# Altium schematic sheet SIX-INPORT.SchDoc
size A3
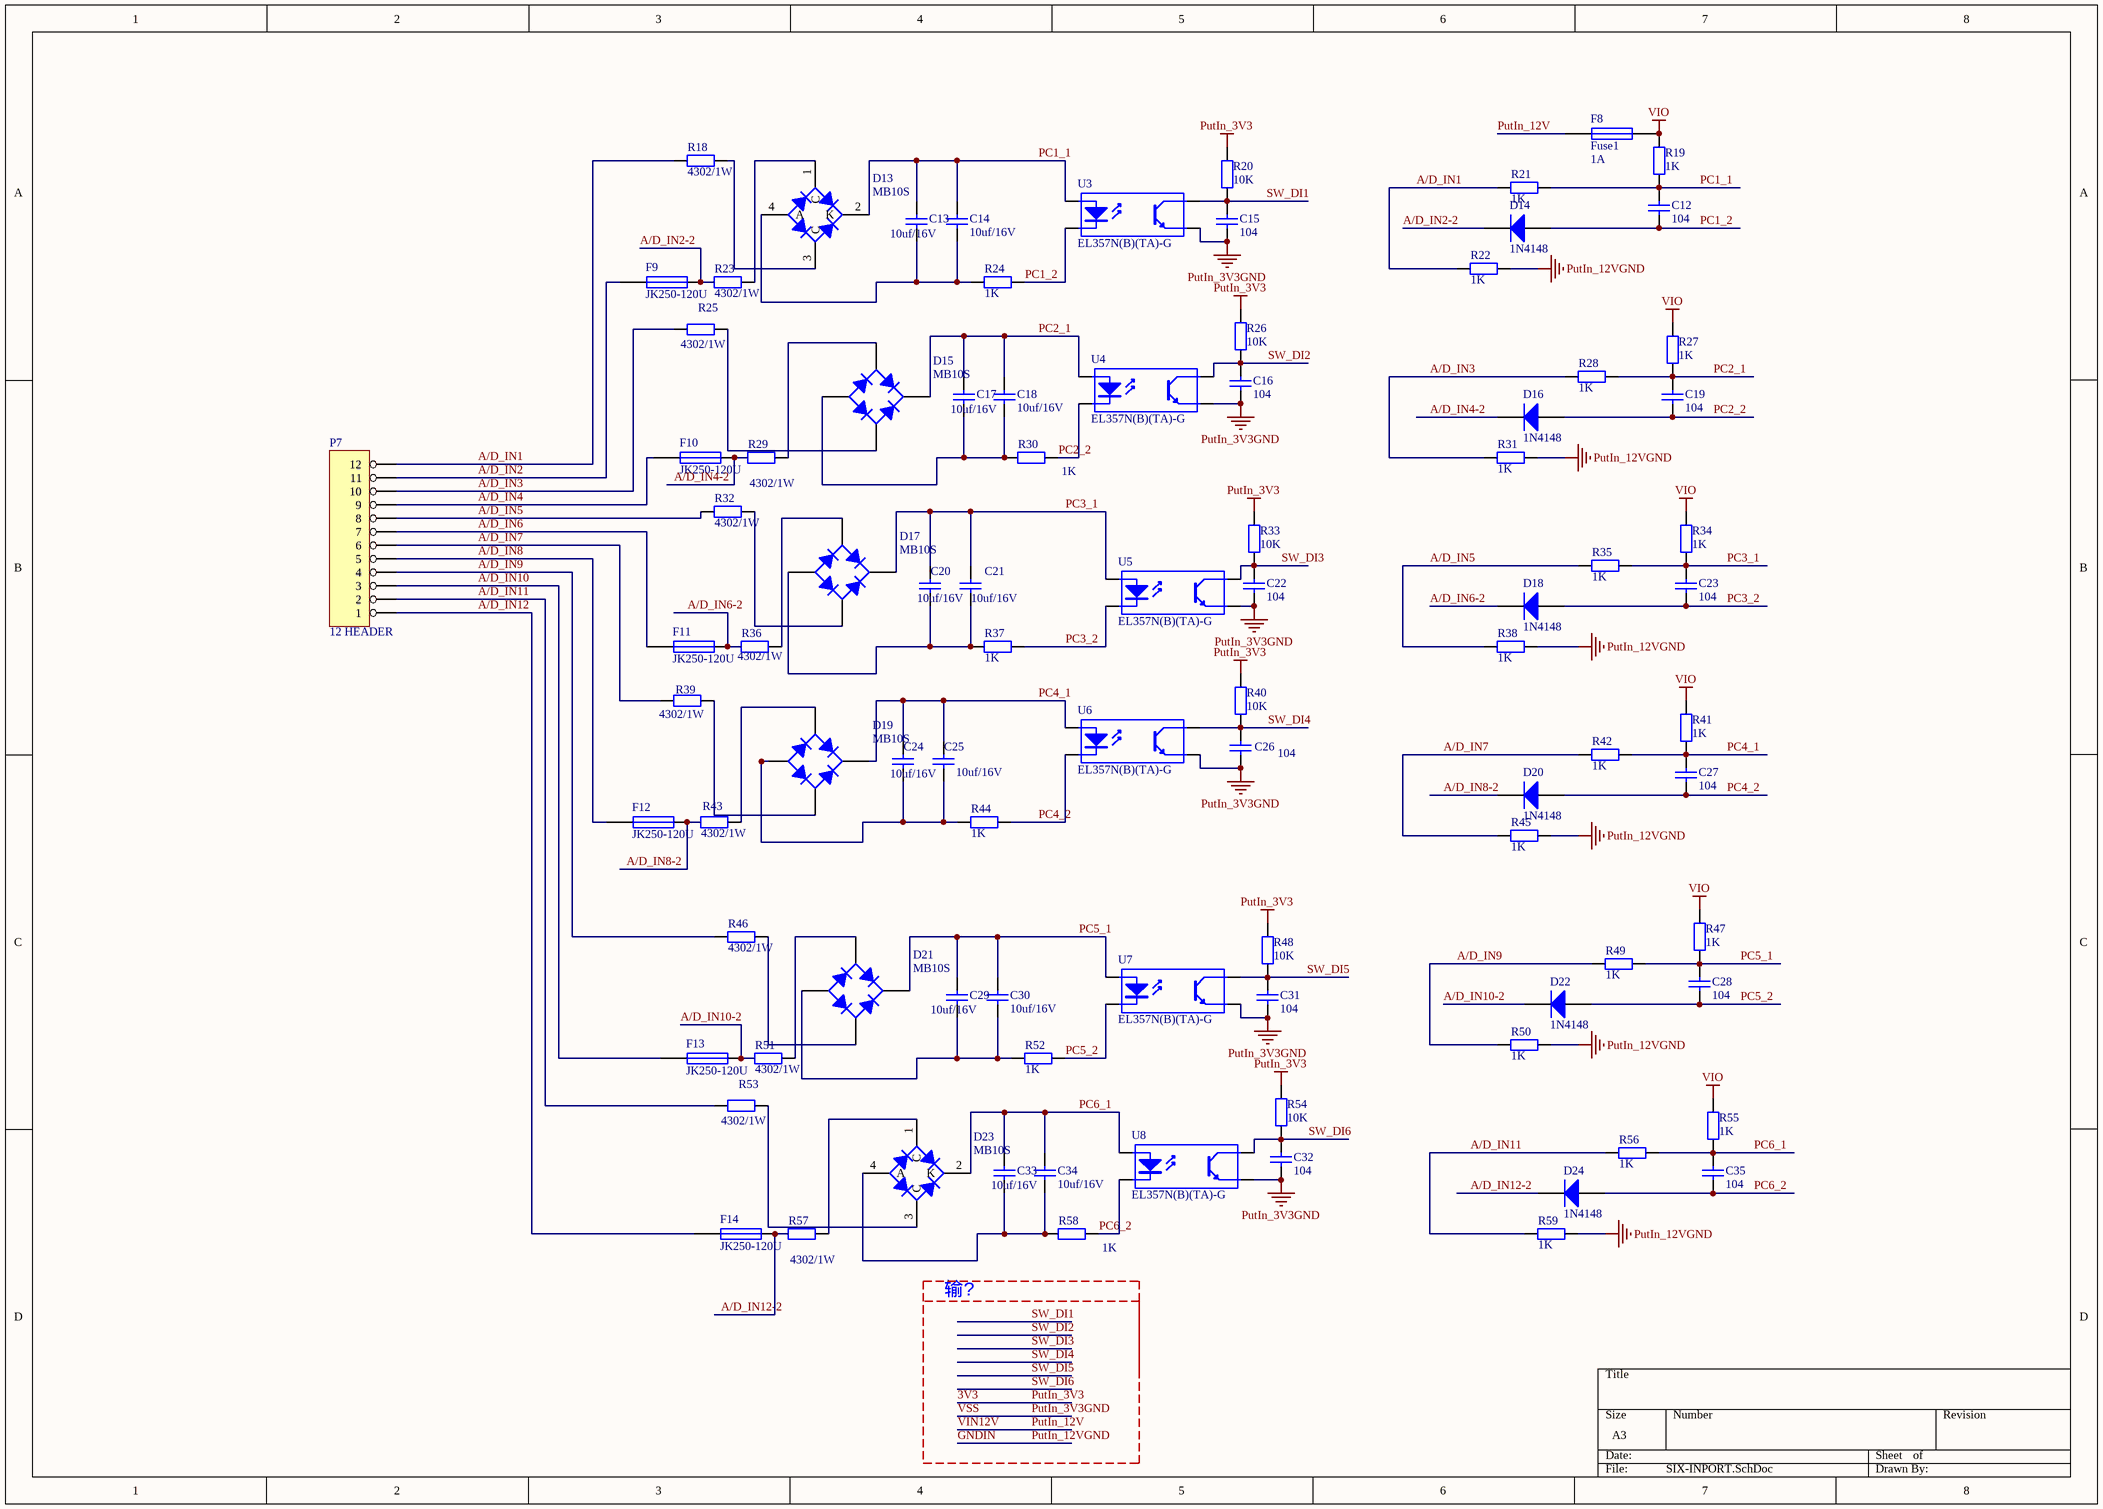
[diagram p0: SIX-INPORT.SchDoc]

## Parts
C12  104  [LC-1206_C]
C13  10uf/16V  [LC-0805_C]
C14  10uf/16V  [LC-0805_C]
C15  104  [LC-0603_C]
C16  104  [LC-0603_C]
C17  10uf/16V  [LC-0805_C]
C18  10uf/16V  [LC-0805_C]
C19  104  [LC-1206_C]
C20  10uf/16V  [LC-0805_C]
C21  10uf/16V  [LC-0805_C]
C22  104  [LC-0603_C]
C23  104  [LC-1206_C]
C24  10uf/16V  [LC-0805_C]
C25  10uf/16V  [LC-0805_C]
C26  104  [LC-0603_C]
C27  104  [LC-1206_C]
C28  104  [LC-1206_C]
C29  10uf/16V  [LC-0805_C]
C30  10uf/16V  [LC-0805_C]
C31  104  [LC-0603_C]
C32  104  [LC-0603_C]
C33  10uf/16V  [LC-0805_C]
C34  10uf/16V  [LC-0805_C]
C35  104  [LC-1206_C]
D13  MB10S  [LC-MBS]
D14  1N4148  [LC-LL-34]
D15  MB10S  [LC-MBS]
D16  1N4148  [LC-LL-34]
D17  MB10S  [LC-MBS]
D18  1N4148  [LC-LL-34]
D19  MB10S  [LC-MBS]
D20  1N4148  [LC-LL-34]
D21  MB10S  [LC-MBS]
D22  1N4148  [LC-LL-34]
D23  MB10S  [LC-MBS]
D24  1N4148  [LC-LL-34]
F8  Fuse1  value 1A  [LC-1206_R]
F9  JK250-120U  [ntc250v]
F10  JK250-120U  [ntc250v]
F11  JK250-120U  [ntc250v]
F12  JK250-120U  [ntc250v]
F13  JK250-120U  [ntc250v]
F14  JK250-120U  [ntc250v]
P7  12 HEADER  [KF2EDG508-12]
R18  4302/1W  [LC-2512_R]
R19  value 1K  [LC-1206_R]  (hidden comment: Res1)
R20  10K  [LC-0603_R]
R21  value 1K  [LC-1206_R]  (hidden comment: Res1)
R22  value 1K  [LC-1206_R]  (hidden comment: Res1)
R23  4302/1W  [LC-2512_R]
R24  1K  [LC-0603_R]
R25  4302/1W  [LC-2512_R]
R26  10K  [LC-0603_R]
R27  value 1K  [LC-1206_R]  (hidden comment: Res1)
R28  value 1K  [LC-1206_R]  (hidden comment: Res1)
R29  4302/1W  [LC-2512_R]
R30  1K  [LC-0603_R]
R31  value 1K  [LC-1206_R]  (hidden comment: Res1)
R32  4302/1W  [LC-2512_R]
R33  10K  [LC-0603_R]
R34  value 1K  [LC-1206_R]  (hidden comment: Res1)
R35  value 1K  [LC-1206_R]  (hidden comment: Res1)
R36  4302/1W  [LC-2512_R]
R37  1K  [LC-0603_R]
R38  value 1K  [LC-1206_R]  (hidden comment: Res1)
R39  4302/1W  [LC-2512_R]
R40  10K  [LC-0603_R]
R41  value 1K  [LC-1206_R]  (hidden comment: Res1)
R42  value 1K  [LC-1206_R]  (hidden comment: Res1)
R43  4302/1W  [LC-2512_R]
R44  1K  [LC-0603_R]
R45  value 1K  [LC-1206_R]  (hidden comment: Res1)
R46  4302/1W  [LC-2512_R]
R47  value 1K  [LC-1206_R]  (hidden comment: Res1)
R48  10K  [LC-0603_R]
R49  value 1K  [LC-1206_R]  (hidden comment: Res1)
R50  value 1K  [LC-1206_R]  (hidden comment: Res1)
R51  4302/1W  [LC-2512_R]
R52  1K  [LC-0603_R]
R53  4302/1W  [LC-2512_R]
R54  10K  [LC-0603_R]
R55  value 1K  [LC-1206_R]  (hidden comment: Res1)
R56  value 1K  [LC-1206_R]  (hidden comment: Res1)
R57  4302/1W  [LC-2512_R]
R58  1K  [LC-0603_R]
R59  value 1K  [LC-1206_R]  (hidden comment: Res1)
U3  EL357N(B)(TA)-G  [LC-SOP-4_P2.54]
U4  EL357N(B)(TA)-G  [LC-SOP-4_P2.54]
U5  EL357N(B)(TA)-G  [LC-SOP-4_P2.54]
U6  EL357N(B)(TA)-G  [LC-SOP-4_P2.54]
U7  EL357N(B)(TA)-G  [LC-SOP-4_P2.54]
U8  EL357N(B)(TA)-G  [LC-SOP-4_P2.54]

## Nets
3V3: R20.2 R26.2 R33.2 R40.2 R48.2 R54.2  [also labelled PutIn_3V3]
GNDIN: R22.1 R31.1 R38.1 R45.1 R50.1 R59.1  [also labelled PutIn_12VGND]
PutIn_3V3GND: C15.2 C16.2 C22.2 C26.2 C31.2 C32.2 U3.3(E) U4.3(E) U5.3(E) U6.3(E) U7.3(E) U8.3(E)  [also labelled VSS]
VIO: F8.2 R19.2 R27.1 R34.1 R41.1 R47.2 R55.1
A/D_IN1: P7.12 R18.1 R21.2 R22.2
A/D_IN2: F9.1 P7.11
A/D_IN2-2: D14.2(K) F9.2 R23.1
A/D_IN3: P7.10 R25.1 R28.2 R31.2
A/D_IN4: F10.1 P7.9
A/D_IN4-2: D16.2(K) F10.2 R29.1
A/D_IN5: P7.8 R32.1 R35.2 R38.2
A/D_IN6: F11.1 P7.7
A/D_IN6-2: D18.2(K) F11.2 R36.1
A/D_IN7: P7.6 R39.1 R42.2 R45.2
A/D_IN8: F12.1 P7.5
A/D_IN8-2: D20.2(K) F12.2 R43.1
A/D_IN9: P7.4 R46.1 R49.2 R50.2
A/D_IN10: F13.1 P7.3
A/D_IN10-2: D22.2(K) F13.2 R51.1
A/D_IN11: P7.2 R53.1 R56.2 R59.2
A/D_IN12: F14.1 P7.1
A/D_IN12-2: D24.2(K) F14.2 R57.1
PC1_1: C12.1 C13.2 C14.2 D13.2(K) R19.1 R21.1 U3.1(A)
PC1_2: C12.2 D14.1(A) R24.1 U3.2(K)
PC2_1: C17.2 C18.2 C19.1 D15.2(K) R27.2 R28.1 U4.1(A)
PC2_2: C19.2 D16.1(A) R30.1 U4.2(K)
PC3_1: C20.2 C21.2 C23.1 D17.2(K) R34.2 R35.1 U5.1(A)
PC3_2: C23.2 D18.1(A) R37.1 U5.2(K)
PC4_1: C24.2 C25.2 C27.1 D19.2(K) R41.2 R42.1 U6.1(A)
PC4_2: C27.2 D20.1(A) R44.1 U6.2(K)
PC5_1: C28.1 C29.2 C30.2 D21.2(K) R47.1 R49.1 U7.1(A)
PC5_2: C28.2 D22.1(A) R52.1 U7.2(K)
PC6_1: C33.2 C34.2 C35.1 D23.2(K) R55.2 R56.1 U8.1(A)
PC6_2: C35.2 D24.1(A) R58.1 U8.2(K)
PutIn_12V: F8.1  [also labelled VIN12V]
SW_DI1: C15.1 R20.1 U3.4(C)
SW_DI2: C16.1 R26.1 U4.4(C)
SW_DI3: C22.1 R33.1 U5.4(C)
SW_DI4: C26.1 R40.1 U6.4(C)
SW_DI5: C31.1 R48.1 U7.4(C)
SW_DI6: C32.1 R54.1 U8.4(C)
NetC13_1: C13.1 C14.1 D13.4(A) R24.2
NetC17_1: C17.1 C18.1 D15.4(A) R30.2
NetC20_1: C20.1 C21.1 D17.4(A) R37.2
NetC24_1: C24.1 C25.1 D19.4(A) R44.2
NetC29_1: C29.1 C30.1 D21.4(A) R52.2
NetC33_1: C33.1 C34.1 D23.4(A) R58.2
NetD13_1: D13.1(C) R23.2
NetD13_3: D13.3(C) R18.2
NetD15_1: D15.1(C) R29.2
NetD15_3: D15.3(C) R25.2
NetD17_1: D17.1(C) R36.2
NetD17_3: D17.3(C) R32.2
NetD19_1: D19.1(C) R43.2
NetD19_3: D19.3(C) R39.2
NetD21_1: D21.1(C) R51.2
NetD21_3: D21.3(C) R46.2
NetD23_1: D23.1(C) R57.2
NetD23_3: D23.3(C) R53.2

## Notes on the sheet
- 输?

## Library data of the parts
C12 C19 C23 C27 C28 C35 = Cap: Capacitor; Value: 100nF; Published: 8-Jun-2000; Revision: July-2002: Re-released for DXP Platform.; Publisher: Altium Limited
C13-C18 C20-C22 C24-C26 C29-C34 = Cap: Capacitor; Value: 100pF; Published: 8-Jun-2000; LatestRevisionDate: 17-Jul-2002; LatestRevisionNote: Re-released for DXP Platform.; PackageReference: RAD-0.3; Publisher: Altium Limited; PackageDescription: Radial Cap, Thru-Hole; 2 Leads; 0.3 in Pin Spacing
D13 D15 D17 D19 D21 D23 = MBS M: 整流桥; ComponentLink1Description: 供应商链接; ComponentLink1URL: http://www.szlcsc.com/product/details_2865.html; Package: MBS; Supplier: LC; SuppliersPartNumber: C2488
D14 D16 D18 D20 D22 D24 = Diode: Default Diode; Published: 8-Jun-2000; LatestRevisionDate: 17-Jul-2002; LatestRevisionNote: Re-released for DXP Platform.; PackageDocument: Sep-1996; PackageReference: SMC; Publisher: Altium Limited; Code_JEDEC: DO-214-AB
F8 = Fus: 保险丝
F9-F14 = F: 保险丝; Value: 1A
P7 = 12 HEADER: 12 Pin Header
R18 R20 R23 R25 R26 R29 R32 R33 R36 R39 R40 R43 R46 R48 R51 R53 R54 R57 = Res2: Resistor; Value: 1K; Published: 8-Jun-2000; LatestRevisionDate: 17-Jul-2002; LatestRevisionNote: Re-released for DXP Platform.; PackageReference: AXIAL-0.4; Publisher: Altium Limited; PackageDescription: Axial Device, Thru-Hole; 2 Leads; 0.4 in Pin Spacing
R19 R21 R22 R27 R28 R31 R34 R35 R38 R41 R42 R45 R47 R49 R50 R55 R56 R59 = Res1: 贴片电阻; Published: 8-Jun-2000; LatestRevisionDate: 17-Jul-2002; LatestRevisionNote: Re-released for DXP Platform.; PackageReference: AXIAL-0.4; Publisher: Altium Limited
R24 R30 R37 R44 R52 R58 = Res2: Resistor; Published: 8-Jun-2000; LatestRevisionDate: 17-Jul-2002; LatestRevisionNote: Re-released for DXP Platform.; PackageReference: AXIAL-0.4; Publisher: Altium Limited; PackageDescription: Axial Device, Thru-Hole; 2 Leads; 0.4 in Pin Spacing; Value: 1K
U3-U8 = EL357N(B): 贴片光耦; ComponentLink1Description: 供应商链接; ComponentLink1URL: http://www.szlcsc.com/product/details_7114.html; Package: SOP-4_P2.54; Supplier: LC; SuppliersPartNumber: C6649